# Altium schematic sheet rev02_7.SchDoc
size 409 x 282 mm
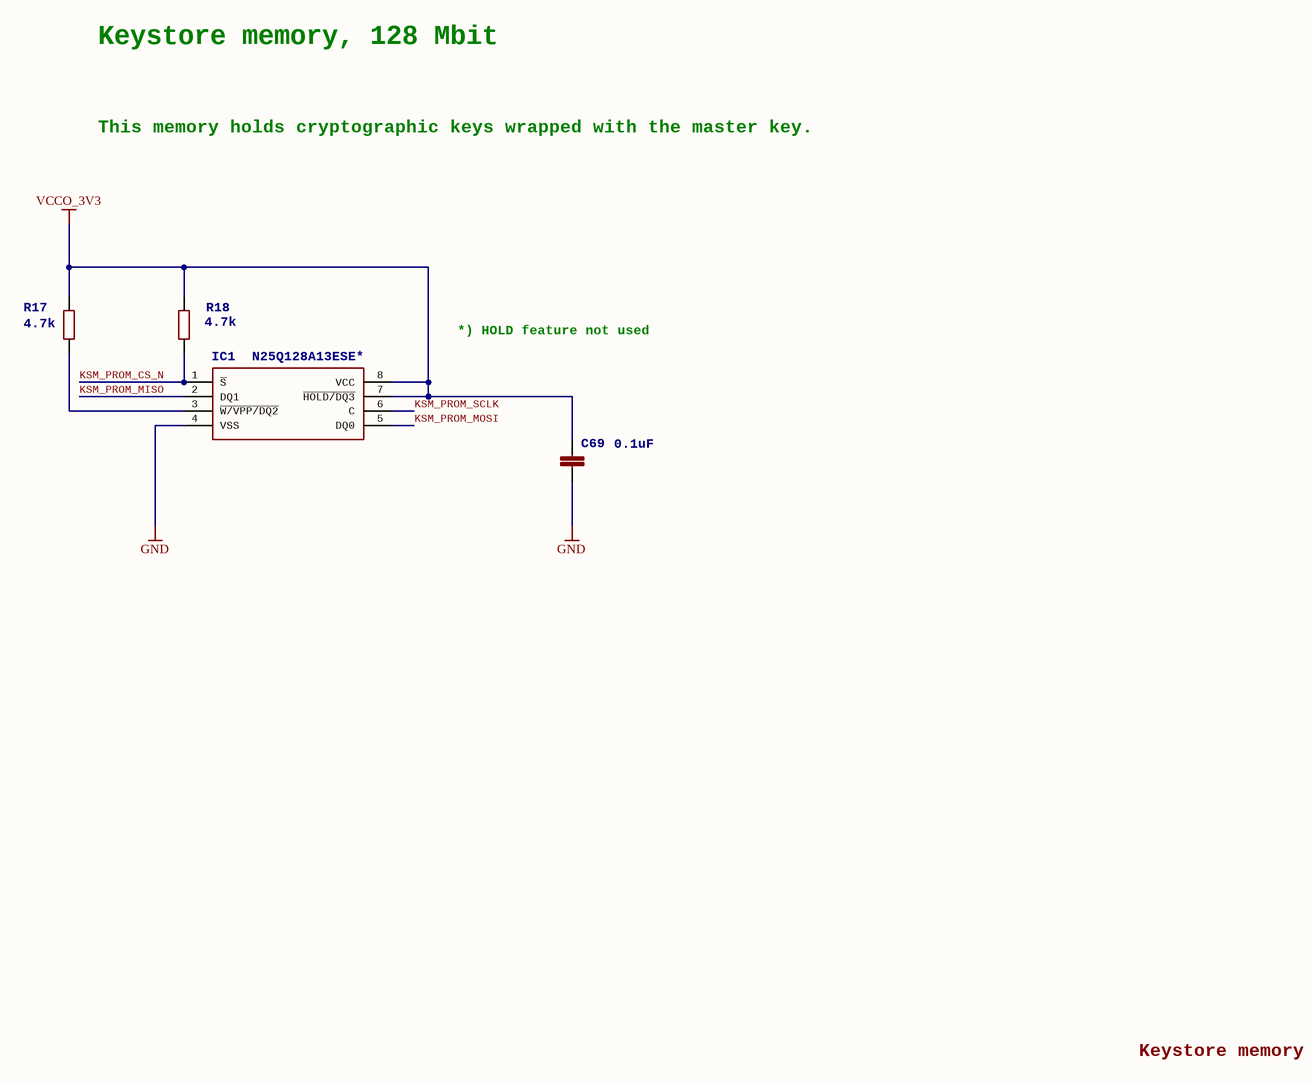
[diagram p0: rev02_7.SchDoc]

## Parts
C69  value 0.1uF  >NAME: C69  [C_0402]
IC1  N25Q128A13ESE*  >Name: IC1  [SO08]
R17  value 4.7k  [R_0402]
R18  value 4.7k  [R_0402]

## Nets
GND: C69.2 IC1.4(VSS)
VCCO_3V3: C69.1 IC1.7(~{HOLD/DQ3}) IC1.8(VCC) R17.1 R18.1
KSM_PROM_CS_N: IC1.1(~{S}) R18.2
KSM_PROM_MISO: IC1.2(DQ1)
KSM_PROM_MOSI: IC1.5(DQ0)
KSM_PROM_SCLK: IC1.6(C)
NetIC1_3: IC1.3(~{W/VPP/DQ2}) R17.2

## Notes on the sheet
- Keystore memory, 128 Mbit
- This memory holds cryptographic keys
  wrapped with the master key.
- *) HOLD feature not used
- Keystore memory

## Library data of the parts
C69 = C-EUC0402: 0402 CAPACITOR; DIELECTRIC: X7R; RATED_VOLTAGE: 50V; TOLERANCE: 10%; >VALUE: 0.1 uF
IC1 = N25Q128A13ES: NOR Flash; OC_DIGIKEY: 557-1562-ND; OC_FARNELL: 2253682; PRICE100_DIGIKEY: 1.30470; PRICE100_FARNELL: 5.10; >Value: N25Q128A13ES
R17 R18 = R-EU_R0402: 0402 Resistor 5%